# EAGLE design Verteilerplatine_Universal_LoetJumper (EAGLE 9.2.0)
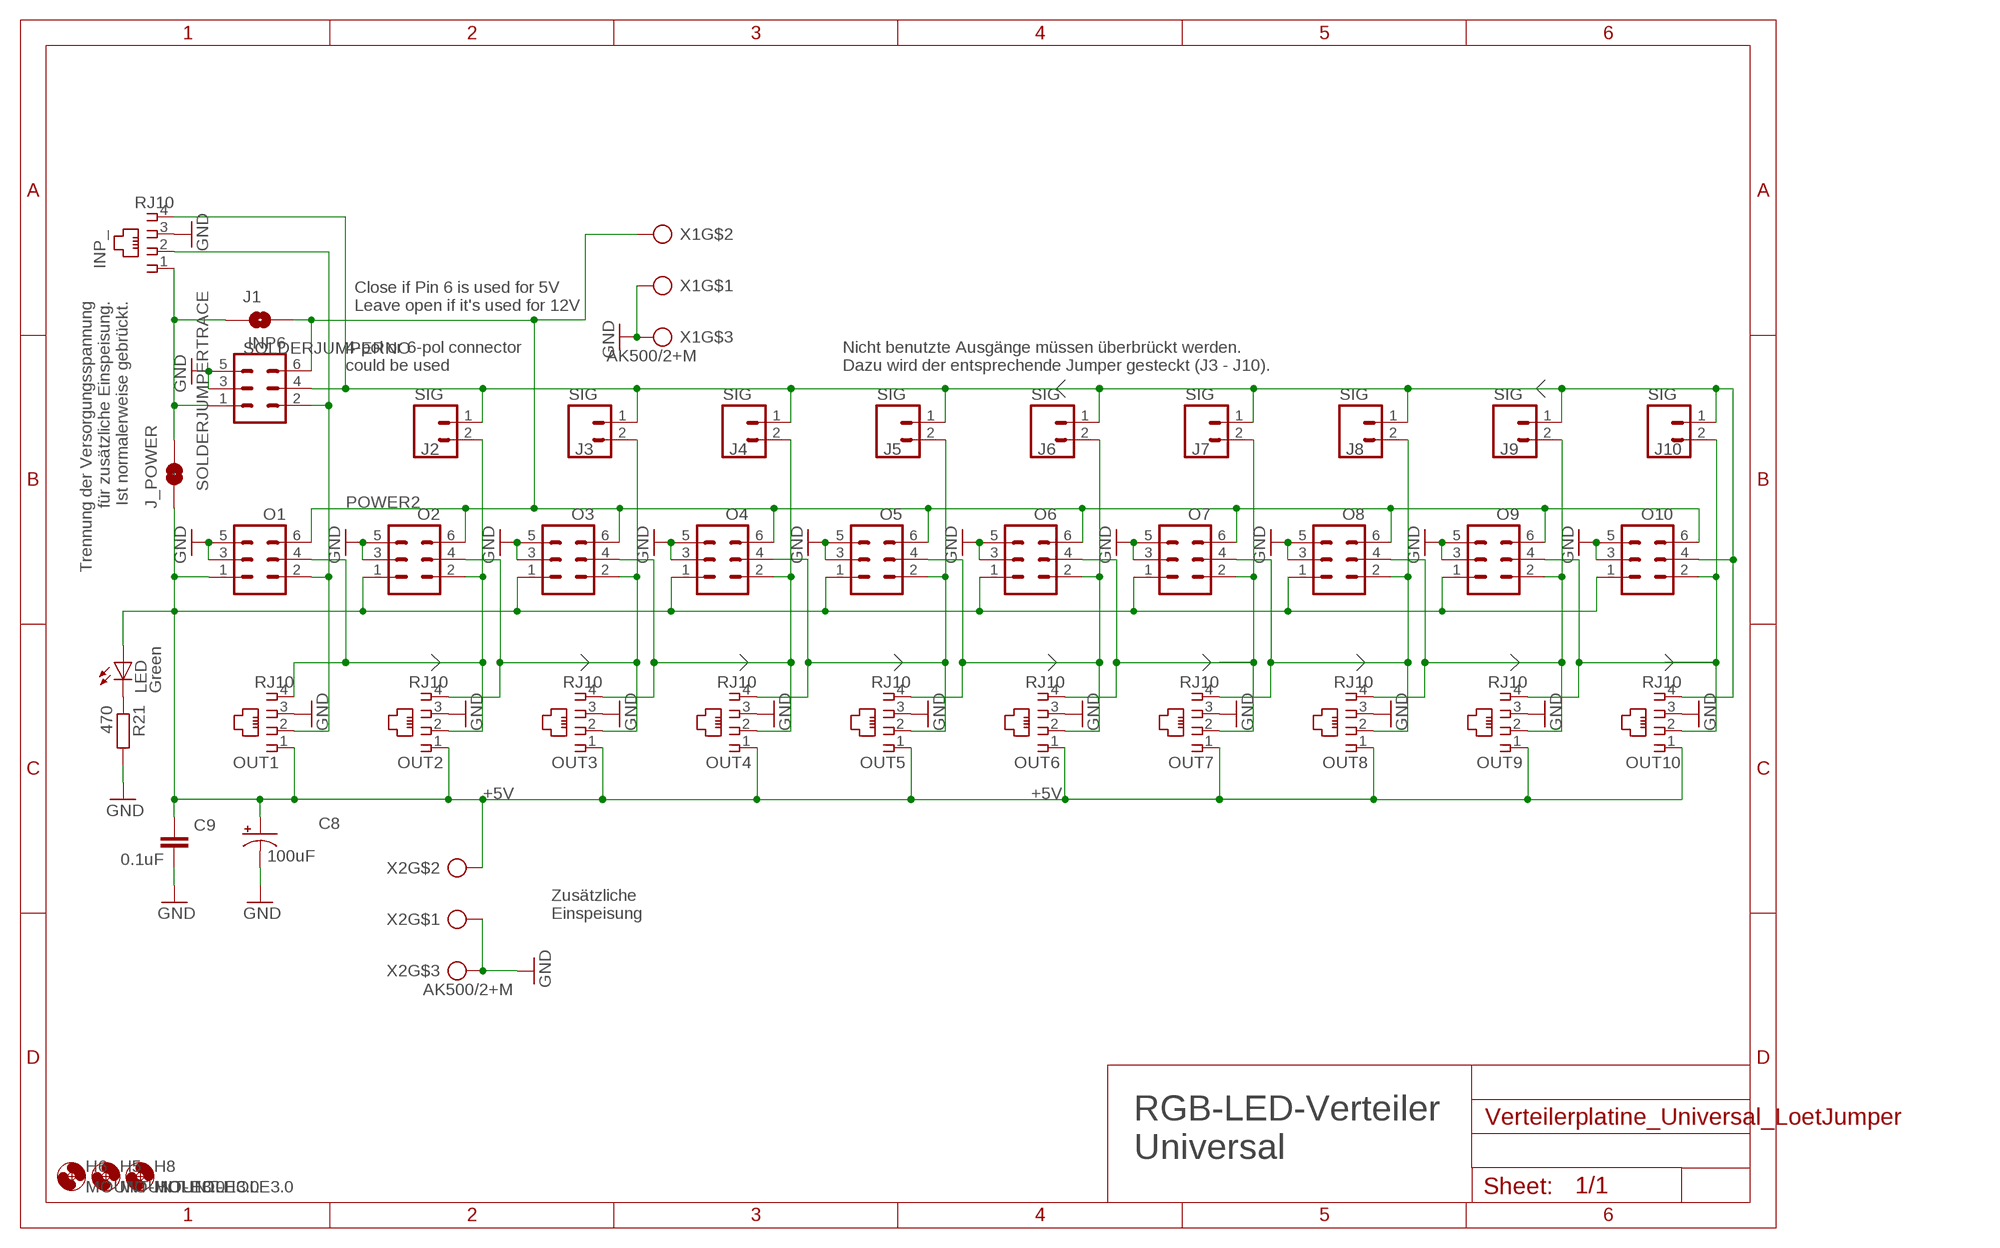
[diagram p0: schematic, sheet 1]

## Parts
C8  100uF  SPARKFUN-CAPACITORS_100UF-25V-20%(PTH)  [SPARKFUN-CAPACITORS_CPOL-RADIAL-100UF-25V]
C9  0.1uF  0.1UF-50V-20%(PTH)KIT-EZ  [CAP-PTH-SMALL-KIT]
H5  MOUNT-HOLE3.0  [3,0]
H6  MOUNT-HOLE3.0  [3,0]
H8  MOUNT-HOLE3.0  [3,0]
INP6  ML6  [ML6]
INP_  RJ10  [RJ10]
J1  SOLDERJUMPERNO  [SJ_2S-NO]
J2  SIG  M02PTH  [1X02]
J3  SIG  M02PTH  [1X02]
J4  SIG  M02PTH  [1X02]
J5  SIG  M02PTH  [1X02]
J6  SIG  M02PTH  [1X02]
J7  SIG  M02PTH  [1X02]
J8  SIG  M02PTH  [1X02]
J9  SIG  M02PTH  [1X02]
J10  SIG  M02PTH  [1X02]
J_POWER  SOLDERJUMPERTRACE  [SJ_2S-TRACE]
LED  Green  LED_LED3MM  [LED_LED3MM]
O1  ML6  [ML6]
O2  ML6  [ML6]
O3  ML6  [ML6]
O4  ML6  [ML6]
O5  ML6  [ML6]
O6  ML6  [ML6]
O7  ML6  [ML6]
O8  ML6  [ML6]
O9  ML6  [ML6]
O10  ML6  [ML6]
OUT1  RJ10  [RJ10]
OUT2  RJ10  [RJ10]
OUT3  RJ10  [RJ10]
OUT4  RJ10  [RJ10]
OUT5  RJ10  [RJ10]
OUT6  RJ10  [RJ10]
OUT7  RJ10  [RJ10]
OUT8  RJ10  [RJ10]
OUT9  RJ10  [RJ10]
OUT10  RJ10  [RJ10]
R21  470  RCL_R-EU_0207/2V  [RCL_0207/2V]
X1  AK500/2+M  [AK500/2+M]
X2  AK500/2+M  [AK500/2+M]

## Nets
5V: C8.1(+) C9.2 J_POWER.1 LED.A O1.1 O2.1 O3.1 O4.1 O5.1 O6.1 O7.1 O8.1 O9.1 O10.1 OUT1.1 OUT2.1 OUT3.1 OUT4.1 OUT5.1 OUT6.1 OUT7.1 OUT8.1 OUT9.1 OUT10.1 X2.2
GND: C8.2(-) C9.1 INP6.3 INP6.5 INP_.3 O1.3 O1.5 O2.3 O2.5 O3.3 O3.5 O4.3 O4.5 O5.3 O5.5 O6.3 O6.5 O7.3 O7.5 O8.3 O8.5 O9.3 O9.5 O10.3 O10.5 OUT1.3 OUT2.3 OUT3.3 OUT4.3 OUT5.3 OUT6.3 OUT7.3 OUT8.3 OUT9.3 OUT10.3 R21.2 X1.1 X1.M X2.1 X2.M
N$1: J10.2 O9.4 O10.2 OUT9.4 OUT10.2
N$2: J7.2 O6.4 O7.2 OUT6.4 OUT7.2
N$3: INP6.2 INP_.2 O1.2 OUT1.2
N$4: J8.2 O7.4 O8.2 OUT7.4 OUT8.2
N$7: INP6.1 INP_.1 J1.1 J_POWER.2
N$8: J2.2 O1.4 O2.2 OUT1.4 OUT2.2
N$11: J3.2 O2.4 O3.2 OUT2.4 OUT3.2
N$16: LED.K(C) R21.1
N$47: J4.2 O3.4 O4.2 OUT3.4 OUT4.2
N$50: J5.2 O4.4 O5.2 OUT4.4 OUT5.2
N$51: J6.2 O5.4 O6.2 OUT5.4 OUT6.2
N$56: INP6.4 INP_.4 J2.1 J3.1 J4.1 J5.1 J6.1 J7.1 J8.1 J9.1 J10.1 O10.4 OUT10.4
N$57: J9.2 O8.4 O9.2 OUT8.4 OUT9.2
POWER2: INP6.6 J1.2 O1.6 O2.6 O3.6 O4.6 O5.6 O6.6 O7.6 O8.6 O9.6 O10.6 X1.2

## Notes on the sheet
- Trennung der Versorgungsspannung
  für zusätzliche Einspeisung.
  Ist normalerweise gebrückt.
- Close if Pin 6 is used for 5V
  Leave open if it's used for 12V
- 4-pol or 6-pol connector
  could be used
- Nicht benutzte Ausgänge müssen überbrückt werden.
  Dazu wird der entsprechende Jumper gesteckt (J3 - J10).
- +5V | +5V
- Zusätzliche
  Einspeisung
- RGB-LED-Verteiler
  Universal

## Library data of the parts
C8 = Sound_MP3-TF-16P_and_WS2811:SPARKFUN-CAPACITORS_100UF-25V-20%(PTH): CAP-08439; PROD_ID: CAP-08439
C9 = SparkFun-Capacitors:0.1UF-50V-20%(PTH): CAP-08370; PROD_ID: CAP-08370
H5 H6 H8 = holes:MOUNT-HOLE: MOUNTING HOLE with drill center marker
INP6 O1-O10 = con-harting-ml:ML6: HARTING; OC_FARNELL: unknown; OC_NEWARK: unknown
INP_ OUT1-OUT10 = RJ10:RJ10: RJ10 Connector "C:\Dat\Märklin\Schaltpläne\Allgemein\RJ10_Stecker_Layout.docx" https://de.aliexpress.com/item/100-pcs-lot-RJ11-Grau-4P4-Telefon-Buchse-4P4C-Telefon-Halter-RJ10-Telefon-Halter-PCB-Empf/32951511491.html?spm=a2g0x.search0604.3.106.53184c516NAPTE&transAbTest=ae803_4&ws_ab_test=searchweb0_0%2Csearchweb201602_3_10065_10068_10547_319_317_10548_10696_10084_453_10083_454_10618_10304_10307_10820_10821_537_10302_536_10902_10843_10059_10884_10887_321_322_10103%2Csearchweb201603_57%2CppcSwitch_0&algo_pvid=cf281ae9-d22a-4418-b1b2-d9dd3eca3a16&algo_expid=cf281ae9-d22a-4418-b1b2-d9dd3eca3a16-15; OC_FARNELL: unknown; OC_NEWARK: unknown
J1 J_POWER = SparkFun-Retired:SOLDERJUMPER: Solder Jumper Standard SMD solder jumper. Used to automate production. Two varients : Normally Open and Normally Closed are the same, but have different paste layers. NC will have a large amount of paste and should jumper during reflow.
J2-J10 = SparkFun-Connectors:M02: Standard 2-pin 0.1" header. Use with - straight break away headers ( PRT-00116) - right angle break away headers (PRT-00553) - swiss pins (PRT-00743) - machine pins (PRT-00117) - female headers (PRT-00115) Molex polarized connector foot print use with: PRT-08233 with associated crimp pins and housings. 2.54_SCREWTERM for use with PRT-10571. 3.5mm Screw Terminal footprints for PRT-08084 5mm Screw Terminal footprints for use with PRT-08432
LED = Sound_MP3-TF-16P_and_WS2811:LED_LED: LED OSRAM: - CHIPLED LG R971, LG N971, LY N971, LG Q971, LY Q971, LO R971, LY R971 LH N974, LH R974 LS Q976, LO Q976, LY Q976 LO Q996 - Hyper CHIPLED LW Q18S LB Q993, LB Q99A, LB R99A - SideLED LS A670, LO A670, LY A670, LG A670, LP A670 LB A673, LV A673, LT A673, LW A673 LH A674 LY A675 LS A676, LA A676, LO A676, LY A676, LW A676 LS A679, LY A679, LG A679 - Hyper Micro SIDELED® LS Y876, LA Y876, LO Y876, LY Y876 LT Y87S - SmartLED LW L88C, LW L88S LB L89C, LB L89S, LG L890 LS L89K, LO L89K, LY L89K LS L896, LA L896, LO L896, LY L896 - TOPLED LS T670, LO T670, LY T670, LG T670, LP T670 LSG T670, LSP T670, LSY T670, LOP T670, LYG T670 LG T671, LOG T671, LSG T671 LB T673, LV T673, LT T673, LW T673 LH T674 LS T676, LA T676, LO T676, LY T676, LB T676, LH T676, LSB T676, LW T676 LB T67C, LV T67C, LT T67C, LS T67K, LO T67K, LY T67K, LW E67C LS E67B, LA E67B, LO E67B, LY E67B, LB E67C, LV E67C, LT E67C LW T67C LS T679, LY T679, LG T679 LS T770, LO T770, LY T770, LG T770, LP T770 LB T773, LV T773, LT T773, LW T773 LH T774 LS E675, LA E675, LY E675, LS T675 LS T776, LA T776, LO T776, LY T776, LB T776 LHGB T686 LT T68C, LB T68C - Hyper Mini TOPLED® LB M676 - Mini TOPLED Santana® LG M470 LS M47K, LO M47K, LY M47K Source: http://www.osram.convergy.de LUXEON: - LUMILED® LXK2-PW12-R00, LXK2-PW12-S00, LXK2-PW14-U00, LXK2-PW14-V00 LXK2-PM12-R00, LXK2-PM12-S00, LXK2-PM14-U00 LXK2-PE12-Q00, LXK2-PE12-R00, LXK2-PE12-S00, LXK2-PE14-T00, LXK2-PE14-U00 LXK2-PB12-K00, LXK2-PB12-L00, LXK2-PB12-M00, LXK2-PB14-N00, LXK2-PB14-P00, LXK2-PB14-Q00 LXK2-PR12-L00, LXK2-PR12-M00, LXK2-PR14-Q00, LXK2-PR14-R00 LXK2-PD12-Q00, LXK2-PD12-R00, LXK2-PD12-S00 LXK2-PH12-R00, LXK2-PH12-S00 LXK2-PL12-P00, LXK2-PL12-Q00, LXK2-PL12-R00 Source: www.luxeon.com KINGBRIGHT: KA-3528ASYC Source: www.kingbright.com
R21 = Sound_MP3-TF-16P_and_WS2811:RCL_R-EU_: RESISTOR, European symbol; SPICEPREFIX: R
X1 X2 = Arduino_fuer_LEDs_DCC_2:AK500/2+M

## Board
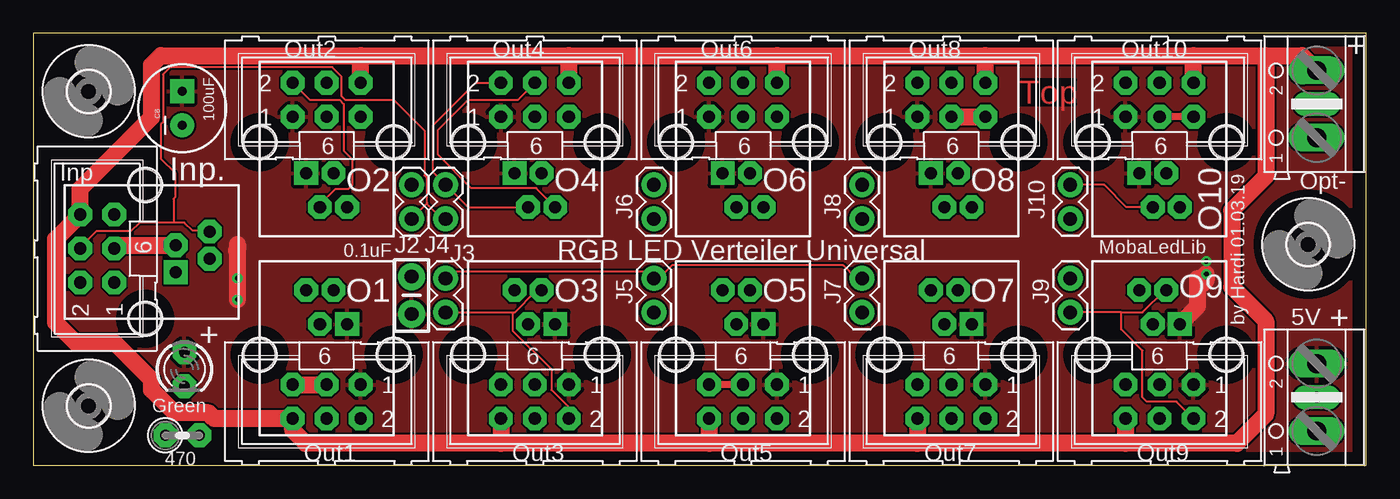
[diagram p1: board, top side]
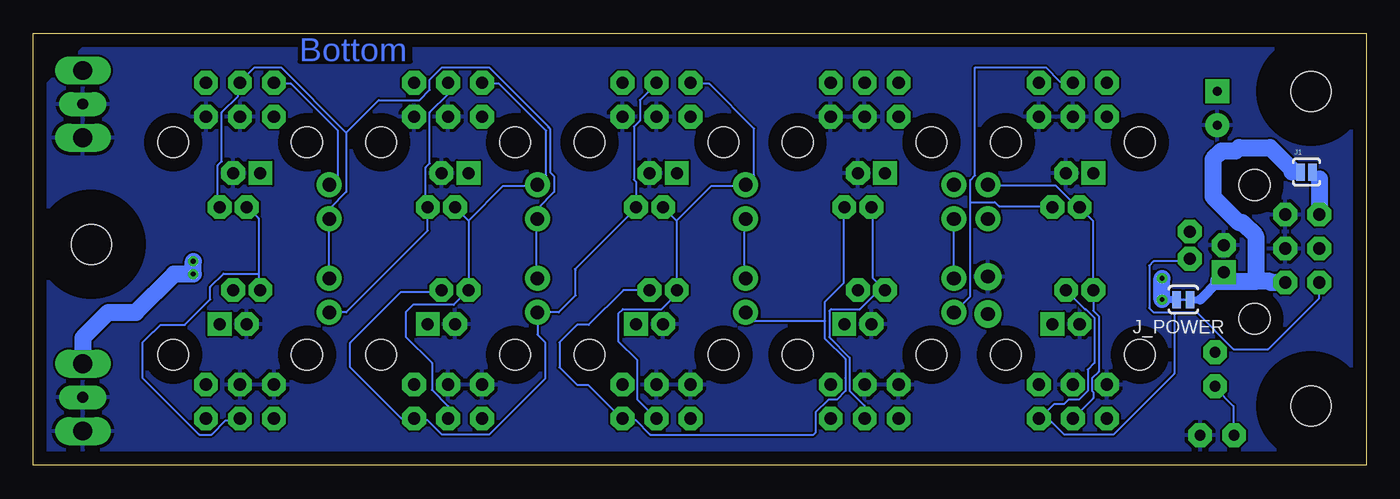
[diagram p2: board, bottom side, seen from below]

Size 99.57 x 32.26 mm. Coordinates in mm from the lower left corner, seen from the top.
Outline: 0,0 99.57,0 99.57,32.26 0,32.26 0,0
Copper layers (1*16): Top 0.035mm / dielectric 1.5mm / Bottom 0.035mm
Design rules "default *": minimum track width 6mil, minimum drill 0.35mm, track to track 6mil, track to pad 6mil, pad to pad 6mil, via to via 6mil, smd to smd 6mil, copper to edge 40mil, drill to drill 6mil, minimum pad ring 10mil, minimum via ring 8mil, stop-mask expansion 4mil, vias tented up to drill 0mil, thermal gap 10mil

### Footprints (pad centres in the part's own frame; a part is rotated, then mirrored left to right if it is on the bottom)
SPARKFUN-CAPACITORS_CPOL-RADIAL-100UF-25V = drill 0.7 pad 1.778 square: 1 1.27,0 | drill 0.7 pad 1.778: 2 -1.27,0
CAP-PTH-SMALL-KIT = drill 1.016 pad 2.032: 1 -1.397,0; 2 1.397,0
3,0 = hole 3: 0,0
ML6 = drill 0.914 pad 1.778 octagon: 1 -2.54,-1.27; 2 -2.54,1.27; 3 0,-1.27; 4 0,1.27; 5 2.54,-1.27; 6 2.54,1.27
RJ10 = drill 0.9 pad 1.778 square: 1 -1.524,-2.3 | drill 0.9 pad 1.778 octagon: 2 -0.508,-4.84; 3 0.508,-2.3; 4 1.524,-4.84 | hole 2.3: 5,0; -5,0
SJ_2S-NO = smd 0.635 x 1.27: 1 -0.45,0; 2 0.45,0
1X02 = drill 1.016 pad 1.88: 1 0,0; 2 2.54,0
SJ_2S-TRACE = smd 0.635 x 1.27: 1 -0.508,0; 2 0.508,0
LED_LED3MM = drill 0.813 pad 1.778 octagon: A -1.27,0; K 1.27,0
RCL_0207/2V = drill 0.813 pad 1.778 octagon: 1 -1.27,0; 2 1.27,0
AK500/2+M = drill 1.397 long: 1 -2.515,0; 2 2.515,0 | drill 0.813 pad 1.778 long: M 0,0

### Placement (x,y rotation side)
C8  11.11,26.67 90 top
C9  28.26,12.7 270 top
H5  4.13,27.94 0 top
H6  4.13,4.45 0 top
H8  95.25,16.51 0 top
INP6  4.76,16.19 90 top
INP_  8.33,15.94 90 top
J1  4.45,21.91 0 bottom
J2  28.26,18.41 90 top
J3  30.8,13.97 270 top
J4  30.8,18.41 90 top
J5  46.35,13.97 270 top
J6  46.35,18.41 90 top
J7  61.91,13.97 270 top
J8  61.91,18.41 90 top
J9  77.47,13.97 270 top
J10  77.47,18.41 90 top
J_POWER  13.65,12.38 0 bottom
LED  11.28,7.18 270 top
O1  21.91,4.76 180 top
O2  21.91,27.3 0 top
O3  37.47,4.76 180 top
O4  37.47,27.3 0 top
O5  53.02,4.76 180 top
O6  53.02,27.3 0 top
O7  68.58,4.76 180 top
O8  68.58,27.3 0 top
O9  84.14,4.76 180 top
O10  84.14,27.3 0 top
OUT1  21.91,8.26 180 top
OUT2  21.91,24.13 0 top
OUT3  37.47,8.26 180 top
OUT4  37.47,24.13 0 top
OUT5  53.02,8.26 180 top
OUT6  53.02,24.13 0 top
OUT7  68.58,8.26 180 top
OUT8  68.58,24.13 0 top
OUT9  84.14,8.26 180 top
OUT10  84.14,24.13 0 top
R21  11.13,2.24 0 top
X1  95.89,26.99 90 top
X2  95.89,5.08 90 top

### Tracks (layer width: path | path; a pad name or v marks a point on that pad's centre or on a via)
5V  (via drill 0.35)
  Top 1.27: OUT9.1 87,11.89 87,13.97 87.39,13.57 87.63,13.81 v87.63,14.29 | v15.24,12.38 v15.24,13.97 15.24,16.12 | 15.24,16.51 15.24,16.12 | 15.24,16.12 15.17,16.05
  Bottom 0.508: J_POWER.1 v15.24,12.38
  Bottom 1.27: X2.2 95.89,9.53 93.98,11.43 91.92,11.43 89.06,14.29 v87.63,14.29 v87.63,15.24 | v15.24,12.38 v15.24,13.97
  pour Top: 3.49,0.32 98.11,0.32 99.38,1.59 99.38,31.43 98.74,32.07 0,32.07 0,3.81
GND
  Top 0.508: O10.5 O10.3 | INP6.3 6.29,16.45 | O5.3 O5.5
  Top 1.27: O1.5 O1.3 | O8.3 O8.5 | 6.29,16.45 INP_.3
  pour Bottom: 2.22,0.32 98.11,0.32 99.38,1.59 99.38,27.62 94.93,32.07 2.22,32.07 0,29.84 0,2.54
N$1
  Top 0.152: OUT10.2 81.67,19.29 80.01,20.95 J10.2
  Bottom 0.152: O10.2 81.53,28.5 80.31,28.5 76.81,24.99 76.81,21.61 J10.2 | 82.75,14.33 82.75,18.44 83.52,19.2 OUT10.2 | 82.75,14.33 82.75,13.11 OUT9.4 | O9.4 84.28,3.35 85.19,3.35 86.26,2.29 87.17,2.29 91.44,6.55 91.44,9.14 90.61,9.97 90.59,9.97 90.07,10.5 88.27,10.5 86.36,12.4 86.36,13.34 85.37,14.33 82.75,14.33
N$2
  Bottom 0.152: OUT7.2 69.19,12.95 72.08,12.95 75.89,9.14 75.89,7.32 72.08,3.5 71.17,3.5 O7.2 71.02,3.35 70.1,3.35 69.04,2.29 65.53,2.29 61.34,6.48 61.34,9.18 61.91,9.76 J7.2 60.33,11.43 59.05,12.7 59.05,14.61 59.11,14.66 54.56,19.2 OUT6.4 54.56,19.36 54.56,21.18 54.71,21.34 54.71,25.3 54.25,25.76 54.25,27.28 53.03,28.5 O6.4
N$3
  Bottom 0.152: 24.08,3.81 24.38,3.5 O1.2 24.08,3.81 | 24.08,3.81 23.32,4.57 22.57,4.57 22.23,4.92 21.45,4.92 20.79,5.57 20.79,7.15 20.28,7.66 20.28,11.02 20.94,11.67 20.99,11.67 OUT1.2 | 14.33,11.43 12.65,11.43 9.91,8.69 7.32,8.69 3.5,12.5 3.5,13.56 INP6.2 | 24.08,3.81 22.55,2.29 18.9,2.29 14.33,6.86 14.33,11.43 | INP_.2 13.36,15.24 15.88,15.24 16.19,14.92 16.19,11.75 15.88,11.43 14.33,11.43
N$4
  Bottom 0.152: O8.2 65.99,28.5 64.77,28.5 61.27,24.99 61.27,21.64 61.87,21.03 J8.2 62.03,20.88 64.47,20.88 67.06,18.29 | 67.06,18.29 OUT7.4 68.17,11.98 71.21,11.98 71.75,11.43 71.75,9.6 69.8,7.64 69.8,5.64 68.58,4.42 O7.4 | 67.06,18.29 67.97,19.2 OUT8.2
N$7
  Bottom 0.508: 10.79,13.65 10.63,13.81 | J1.1 5.53,21.91 | J_POWER.2 12.38,12.38
  Bottom 0.762: 12.38,12.38 11.03,13.74 10.88,13.74 10.79,13.65
  Bottom 1.27: INP6.1 7.08,13.65 7.17,13.74 8.26,13.74 | 11.03,13.74 8.26,13.74 | 8.26,13.74 8.26,17.14 9.25,18.14 9.49,18.14 11.43,20.07 11.43,22.86 10.79,23.5 9.74,23.5 9.49,23.74 7.17,23.74 5.53,22.1 5.53,21.91 | INP_.1 10.63,13.81
N$8
  Top 0.152: O2.2 20.64,27.3 22.86,27.3 23.18,26.99 23.18,23.5 23.81,22.86 23.81,20.95 23.5,20.64 22.54,20.64 21.4,19.49 OUT2.2
  Bottom 0.152: 21.03,18.9 21.34,19.2 OUT2.2 | 21.03,18.9 20.42,18.29 20.42,13.11 OUT1.4 20.38,11.55 19.98,11.14 19.98,7 20.48,6.5 20.48,5.57 20.38,5.47 20.38,5.02 O1.4 | 21.03,18.9 OUT2.2 | J2.2 28.19,20.88 23.16,20.88 21.49,19.2 OUT2.2
N$11
  Top 0.152: J3.2 35.81,11.43 | 35.81,11.43 35.97,11.43 37.49,12.95 37.95,12.95 OUT3.2 | 35.81,11.43 35.81,10.06 38.71,7.16 38.71,5.64 39.93,4.42 39.93,3.5 O3.2
  Bottom 0.152: O2.4 21.95,28.65 22.86,28.65 23.93,29.72 29.21,29.72 29.21,21.66 29.57,21.3 29.57,19.66 | 29.57,19.66 27.74,19.66 27.43,19.36 23.47,19.36 OUT2.4 | 29.57,19.66 29.57,12.65 30.79,11.43 J3.2
N$16
  Bottom 0.152: R21.1 9.91,2.29 9.91,4.42 11.28,5.79 LED.K
N$47
  Top 0.152: O4.2 33.02,28.57 29.84,25.4 29.84,21.91 J4.2 32.46,19.29 OUT4.2
  Bottom 0.152: OUT4.2 36.88,19.2 36.88,14.02 36.87,14.02 OUT3.4 35.94,13.08 36.41,13.08 37.81,11.67 39.97,11.67 40.11,11.54 40.11,9.57 38.58,8.05 38.58,5.57 37.47,4.45 O3.4
N$50
  Top 0.152: OUT4.4 37.57,20.71 32.71,20.71 30.22,23.2 30.22,25.06 32.47,27.3 36.2,27.3 O4.4
  Bottom 0.152: OUT4.4 39.01,19.2 39.01,13.63 40.41,12.24 40.41,10.79 | 55.51,3.41 55.47,3.35 54.56,3.35 53.49,2.29 41.27,2.29 41.12,2.44 41.12,3.96 40.16,4.92 39.54,4.92 38.89,5.57 38.89,6.5 38.91,6.52 38.91,7.95 40.41,9.45 40.41,10.79 | 55.51,3.41 O5.2 | OUT5.2 55.48,13.1 58.08,10.5 58.95,10.5 60.27,9.18 60.27,7.33 58.95,6.01 58.11,6.01 55.51,3.41 | J5.2 45.72,10.79 40.41,10.79
N$51
  Bottom 0.152: O6.2 50.44,28.5 49.07,28.5 45.72,25.15 45.72,21.64 46.33,21.03 J6.2 46.48,20.88 48.92,20.88 51.51,18.29 | 51.51,18.29 51.51,13.11 OUT5.4 51.36,12.95 52.64,11.67 55.53,11.67 55.88,11.32 55.88,9.28 54.45,7.85 54.45,4.92 O5.4 | 51.51,18.29 52.43,19.2 OUT6.2
N$56
  Top 0.152: 10.48,18.14 11.28,18.14 11.89,17.53 13.11,17.53 INP_.4 | 10.48,18.14 7.92,18.14 7.28,17.49 7.25,17.51 4.71,17.51 3.5,16.31 INP6.4 | J7.1 61.87,14.02 61.42,14.02 60.5,14.94 47.7,14.94 46.79,14.02 46.48,14.02 J5.1 46.33,14.02 45.87,14.48 30.79,14.48 | J2.1 29.38,19.54 | 29.38,19.54 29.43,19.58 29.43,21.44 29.21,21.66 29.21,25 26.9,27.3 23.29,27.3 23.02,27.57 23.02,29.04 22.32,29.74 10.22,29.74 9.69,29.21 9.69,25.64 9.53,25.47 9.53,22.92 10.57,21.87 10.57,20.01 10.48,19.91 10.48,18.14 | 30.79,14.48 30.79,14.02 J3.1 30.79,14.48 | 29.38,19.54 30.48,18.44 30.79,18.44 J4.1
  Bottom 0.152: J5.1 46.48,14.02 46.48,18.29 J6.1 | J7.1 62.03,14.02 62.03,18.29 J8.1 61.87,18.44 61.87,19.2 60.66,20.42 60.66,21.59 60.96,21.89 60.96,25.12 61.09,25.25 61.09,25.27 65.53,29.72 69.04,29.72 69.95,28.8 69.95,28.04 70.71,27.28 73.76,27.28 76.2,24.84 | OUT10.4 85.8,19.36 85.8,22.4 85.5,22.71 85.5,26.36 84.28,27.58 84.28,28.5 O10.4 84.12,28.65 83.06,29.72 81.08,29.72 76.2,24.84 | 76.2,24.84 76.2,20.42 77.42,19.2 77.42,18.47 J10.1 J9.1 | J3.1 J4.1
N$57
  Top 0.152: O9.2 85.41,4.76 83.19,4.76 82.87,5.08 82.87,8.57 81.28,10.16 81.28,11.43 | 81.28,11.43 J9.2 | OUT9.2 84.53,13.1 82.87,11.43 81.28,11.43
  Bottom 0.152: O8.4 68.58,27.74 69.95,26.36 69.95,22.55 70.26,22.25 70.26,19.51 70.1,19.36 OUT8.4 70.1,17.53 76.2,11.43 J9.2
POWER2
  Top 1.27: X1.2 94.78,30.61 92.08,30.61 | 24.45,30.61 9.53,30.61 8.83,29.91 8.83,25.99 3.49,20.66 INP6.6 1.65,16.89 1.65,10.67 3.17,9.14 6.07,9.14 8.83,6.39 8.83,5.64 10.55,3.91 13.09,3.91 13.51,3.49 O1.6 19.37,2.6 20.32,1.65 34.92,1.65 | 24.45,30.61 40.01,30.61 | 40.01,30.61 55.56,30.61 | 55.56,30.61 71.12,30.61 | 71.12,30.61 86.68,30.61 | 86.68,30.61 92.08,30.61 | O10.6 86.68,30.61 | O8.6 71.12,30.61 | O6.6 55.56,30.61 | O2.6 24.45,30.61 | 92.08,30.61 92.08,21.59 89.53,19.05 89.53,13.34 92.08,10.79 92.08,3.81 89.92,1.65 81.6,1.65 | 81.6,1.65 66.04,1.65 | 66.04,1.65 50.48,1.65 | 50.48,1.65 34.92,1.65 | O5.6 50.48,1.65 | O7.6 66.04,1.65 | O9.6 81.6,1.65 | O4.6 40.01,30.61 | O3.6 34.92,1.65
  Bottom 0.508: J1.2 3.49,21.41
  Bottom 1.27: 3.49,21.41 INP6.6

### Text on the board
Top: Top
Bottom: Bottom
tPlace: Inp. | Opt- | RGB LED Verteiler Universal | MobaLedLib | by Hardi 01.03.19 | 5V | +
tNames: Out2 | Out4 | Out6 | Out8 | Out10 | + | Inp | O2 | O4 | O6 | O8 | O10 | J6 | J8 | J10 | J4 | J3 | 0.1uF | J2 | O1 | O3 | J5 | O5 | J7 | O7 | J9 | O9 | + | Out1 | Out3 | Out5 | Out7 | Out9